# EAGLE design Expansionv3 (EAGLE 8.5.0)

## Sheet 1 of 2
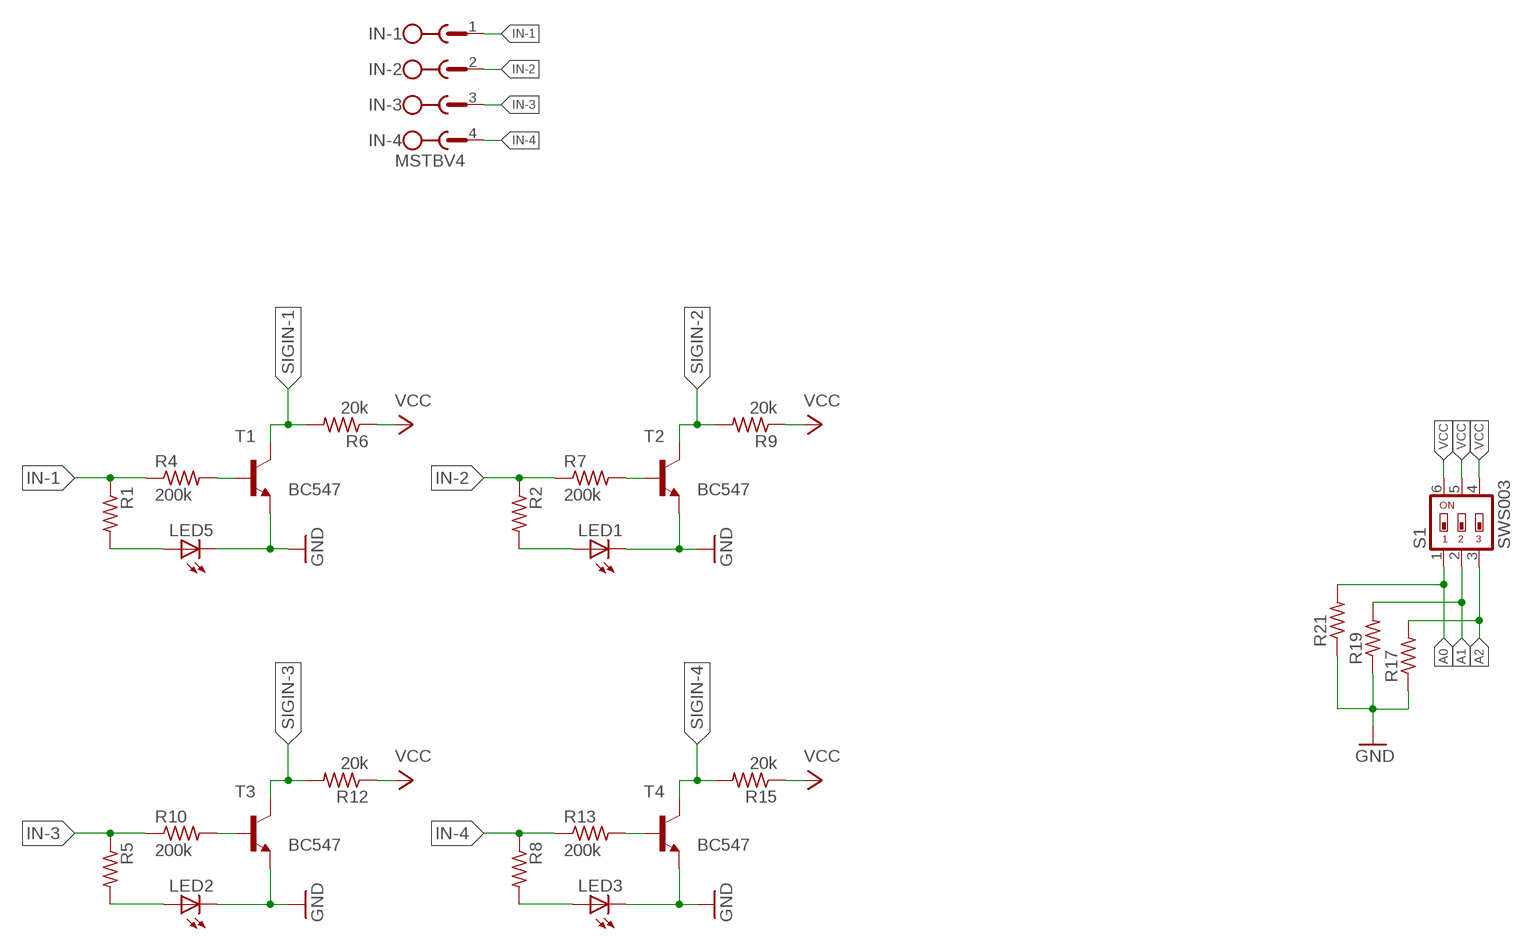
[diagram p0: schematic, sheet 1, part 1 of 2]
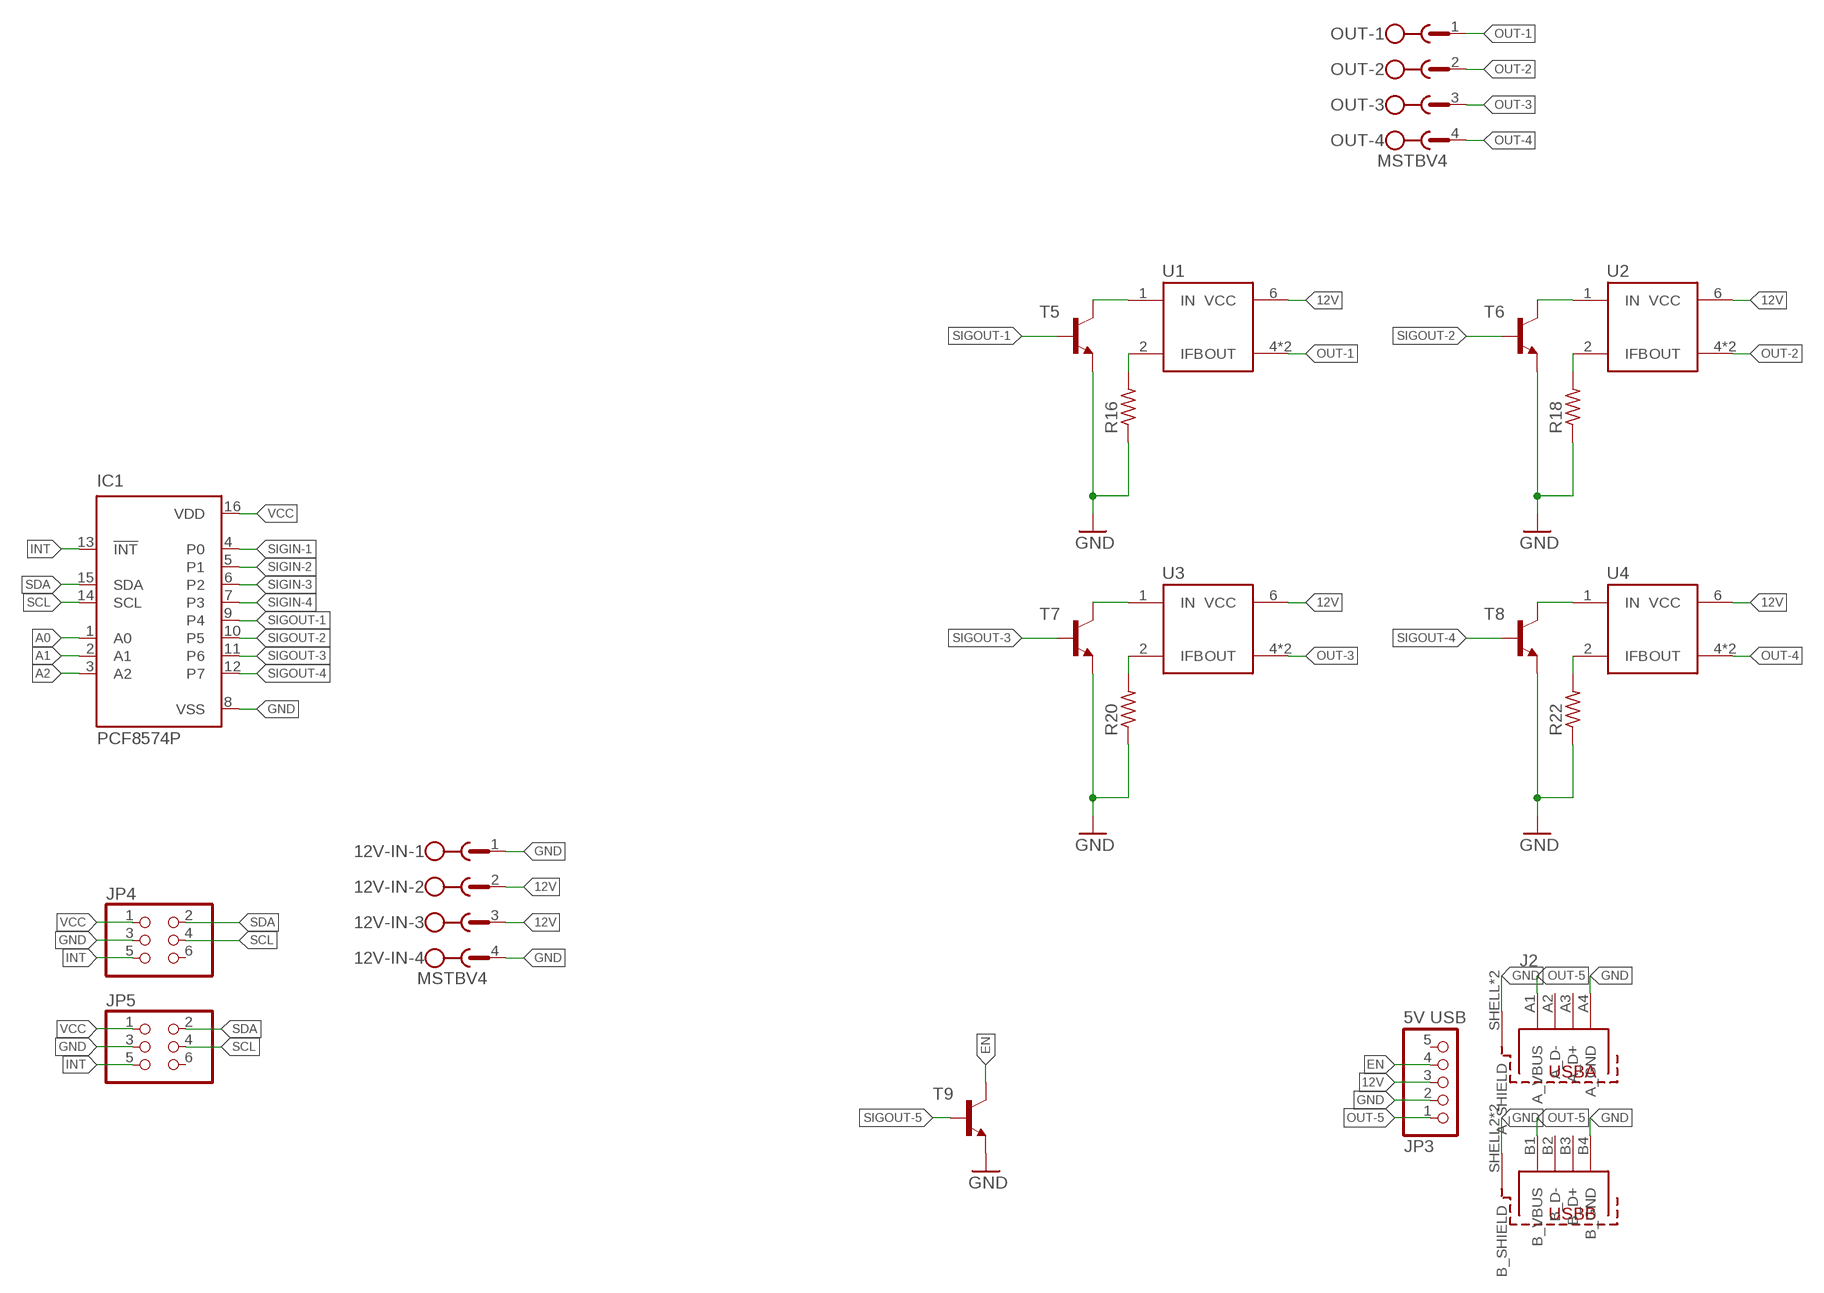
[diagram p1: schematic, sheet 1, part 2 of 2]

### Parts
12V-IN  MSTBV4  [MSTBV4]
IC1  PCF8574P  [DIL16]
IN  MSTBV4  [MSTBV4]
J2  614008235023  [614008235023]
JP3  5V USB  PINHD-1X5  [1X05]
JP4  PINHD-2X3  [2X03]
JP5  PINHD-2X3  [2X03]
LED1  LEDCHIPLED_0805  [CHIPLED_0805]
LED2  LEDCHIPLED_0805  [CHIPLED_0805]
LED3  LEDCHIPLED_0805  [CHIPLED_0805]
LED5  LEDCHIPLED_0805  [CHIPLED_0805]
OUT  MSTBV4  [MSTBV4]
R1  R-US_R0805  [R0805]
R2  R-US_R0805  [R0805]
R4  200k  R-US_R0805  [R0805]
R5  R-US_R0805  [R0805]
R6  20k  R-US_R0805  [R0805]
R7  200k  R-US_R0805  [R0805]
R8  R-US_R0805  [R0805]
R9  20k  R-US_R0805  [R0805]
R10  200k  R-US_R0805  [R0805]
R12  20k  R-US_R0805  [R0805]
R13  200k  R-US_R0805  [R0805]
R15  20k  R-US_R0805  [R0805]
R16  R-US_R0805  [R0805]
R17  R-US_R0805  [R0805]
R18  R-US_R0805  [R0805]
R19  R-US_R0805  [R0805]
R20  R-US_R0805  [R0805]
R21  R-US_R0805  [R0805]
R22  R-US_R0805  [R0805]
S1  SWS003  [SMS-003]
T1  BC547  -NPN-SOT23-EBC  [SOT23-EBC]
T2  BC547  -NPN-SOT23-EBC  [SOT23-EBC]
T3  BC547  -NPN-SOT23-EBC  [SOT23-EBC]
T4  BC547  -NPN-SOT23-EBC  [SOT23-EBC]
T5  -NPN-SOT23-EBC  [SOT23-EBC]
T6  -NPN-SOT23-EBC  [SOT23-EBC]
T7  -NPN-SOT23-EBC  [SOT23-EBC]
T8  -NPN-SOT23-EBC  [SOT23-EBC]
T9  -NPN-SOT23-EBC  [SOT23-EBC]
U1  IR3315  [TO263-5]
U2  IR3315  [TO263-5]
U3  IR3315  [TO263-5]
U4  IR3315  [TO263-5]

### Nets
12V [pwr]: 12V-IN.2 12V-IN.3 JP3.3 U1.6(VCC) U2.6(VCC) U3.6(VCC) U4.6(VCC)
A0: IC1.1(A0) R21.2 S1.1
A1: IC1.2(A1) R19.2 S1.2
A2: IC1.3(A2) R17.2 S1.3
EN: JP3.4 T9.C
GND: 12V-IN.1 12V-IN.4 IC1.8(VSS) J2.A4(A_GND) J2.B4(B_GND) J2.SHELL1(A_SHIELD) J2.SHELL2(B_SHIELD) J2.SHELL3(B_SHIELD) J2.SHELL(A_SHIELD) JP3.2 JP4.3 JP5.3 LED1.C LED2.C LED3.C LED5.C R16.1 R17.1 R18.1 R19.1 R20.1 R21.1 R22.1 T1.E T2.E T3.E T4.E T5.E T6.E T7.E T8.E T9.E
IN-1: IN.1 R1.1 R4.1
IN-2: IN.2 R2.1 R7.1
IN-3: IN.3 R5.1 R10.1
IN-4: IN.4 R8.1 R13.1
INT: IC1.13(!INT) JP4.5 JP5.5
N$3: LED5.A R1.2
N$4: R4.2 T1.B
N$5: LED1.A R2.2
N$6: R7.2 T2.B
N$7: LED2.A R5.2
N$8: R10.2 T3.B
N$9: LED3.A R8.2
N$10: R13.2 T4.B
N$12: T5.C U1.1(IN)
N$13: R16.2 U1.2(IFB)
N$15: T6.C U2.1(IN)
N$16: R18.2 U2.2(IFB)
N$18: T7.C U3.1(IN)
N$19: R20.2 U3.2(IFB)
N$21: T8.C U4.1(IN)
N$22: R22.2 U4.2(IFB)
OUT-1 [pwr]: OUT.1 U1.4(OUT) U1.5(OUT)
OUT-2 [pwr]: OUT.2 U2.4(OUT) U2.5(OUT)
OUT-3 [pwr]: OUT.3 U3.4(OUT) U3.5(OUT)
OUT-4 [pwr]: OUT.4 U4.4(OUT) U4.5(OUT)
OUT-5: J2.A1(A_VBUS) J2.B1(B_VBUS) JP3.1
SCL: IC1.14(SCL) JP4.4 JP5.4
SDA: IC1.15(SDA) JP4.2 JP5.2
SIGIN-1: IC1.4(P0) R6.2 T1.C
SIGIN-2: IC1.5(P1) R9.2 T2.C
SIGIN-3: IC1.6(P2) R12.2 T3.C
SIGIN-4: IC1.7(P3) R15.2 T4.C
SIGOUT-1: IC1.9(P4) T5.B
SIGOUT-2: IC1.10(P5) T6.B
SIGOUT-3: IC1.11(P6) T7.B
SIGOUT-4: IC1.12(P7) T8.B
SIGOUT-5: T9.B
VCC: IC1.16(VDD) JP4.1 JP5.1 R6.1 R9.1 R12.1 R15.1 S1.4 S1.5 S1.6
Unconnected: J2.A2(A_D-) J2.A3(A_D+) J2.B2(B_D-) J2.B3(B_D+) JP3.5 JP4.6 JP5.6

## Sheet 2 of 2

## Library data of the parts
12V-IN IN OUT = con-phoenix-508:MSTBV4: PHOENIX; MPN: MSTBV 2,5/4-GF-5.08; OC_FARNELL: 1792794; OC_NEWARK: 69R9847
IC1 = micro-philips:PCF8574: I2C-Bus Remote 8-bit I/O expander http://www.semiconductors.philips.com/acrobat_download/datasheets/PCF8574_4.pdf; MPN: PCF8574PN; OC_FARNELL: 204020; OC_NEWARK: 11N8515
J2 = InputOutputIO (rev17e):614008235023: WR-COM Vertical Dual USB Type A=>Code : Con_I-O_COM_USB-2.0_A_614008235023 <http://katalog.we-online.de/media/images/eican/Con_I-O_COM_USB-2.0_A_614008235023_pf2.jpg> Details see: http://katalog.we-online.de/en/em/614_008_235_023 Created 2014-07-09, Karrer Zheng 2014 (C) Würth Elektronik
JP3 = pinhead:PINHD-1X5: PIN HEADER
JP4 JP5 = pinhead:PINHD-2X3: PIN HEADER
LED1-LED3 LED5 = led:LED: LED OSRAM: - CHIPLED LG R971, LG N971, LY N971, LG Q971, LY Q971, LO R971, LY R971 LH N974, LH R974 LS Q976, LO Q976, LY Q976 LO Q996 - Hyper CHIPLED LW Q18S LB Q993, LB Q99A, LB R99A - SideLED LS A670, LO A670, LY A670, LG A670, LP A670 LB A673, LV A673, LT A673, LW A673 LH A674 LY A675 LS A676, LA A676, LO A676, LY A676, LW A676 LS A679, LY A679, LG A679 - Hyper Micro SIDELED® LS Y876, LA Y876, LO Y876, LY Y876 LT Y87S - SmartLED LW L88C, LW L88S LB L89C, LB L89S, LG L890 LS L89K, LO L89K, LY L89K LS L896, LA L896, LO L896, LY L896 - TOPLED LS T670, LO T670, LY T670, LG T670, LP T670 LSG T670, LSP T670, LSY T670, LOP T670, LYG T670 LG T671, LOG T671, LSG T671 LB T673, LV T673, LT T673, LW T673 LH T674 LS T676, LA T676, LO T676, LY T676, LB T676, LH T676, LSB T676, LW T676 LB T67C, LV T67C, LT T67C, LS T67K, LO T67K, LY T67K, LW E67C LS E67B, LA E67B, LO E67B, LY E67B, LB E67C, LV E67C, LT E67C LW T67C LS T679, LY T679, LG T679 LS T770, LO T770, LY T770, LG T770, LP T770 LB T773, LV T773, LT T773, LW T773 LH T774 LS E675, LA E675, LY E675, LS T675 LS T776, LA T776, LO T776, LY T776, LB T776 LHGB T686 LT T68C, LB T68C - Hyper Mini TOPLED® LB M676 - Mini TOPLED Santana® LG M470 LS M47K, LO M47K, LY M47K Source: http://www.osram.convergy.de LUXEON: - LUMILED® LXK2-PW12-R00, LXK2-PW12-S00, LXK2-PW14-U00, LXK2-PW14-V00 LXK2-PM12-R00, LXK2-PM12-S00, LXK2-PM14-U00 LXK2-PE12-Q00, LXK2-PE12-R00, LXK2-PE12-S00, LXK2-PE14-T00, LXK2-PE14-U00 LXK2-PB12-K00, LXK2-PB12-L00, LXK2-PB12-M00, LXK2-PB14-N00, LXK2-PB14-P00, LXK2-PB14-Q00 LXK2-PR12-L00, LXK2-PR12-M00, LXK2-PR14-Q00, LXK2-PR14-R00 LXK2-PD12-Q00, LXK2-PD12-R00, LXK2-PD12-S00 LXK2-PH12-R00, LXK2-PH12-S00 LXK2-PL12-P00, LXK2-PL12-Q00, LXK2-PL12-R00 Source: www.luxeon.com KINGBRIGHT: KA-3528ASYC Source: www.kingbright.com
R1 R2 R4-R10 R12 R13 R15-R22 = resistor:R-US_: RESISTOR, American symbol
S1 = smd-special:SWS003: SMD Dip Switch 3 pol.
T1-T9 = transistor:*-NPN-: NPN Transistror BF959 corrected 2008.03.06
U1-U4 = jgennari:IR3315

## Net classes
0 default: width 0.203 mm, drill 0.305 mm
1 pwr: width 0.559 mm, drill 0.305 mm

## Board
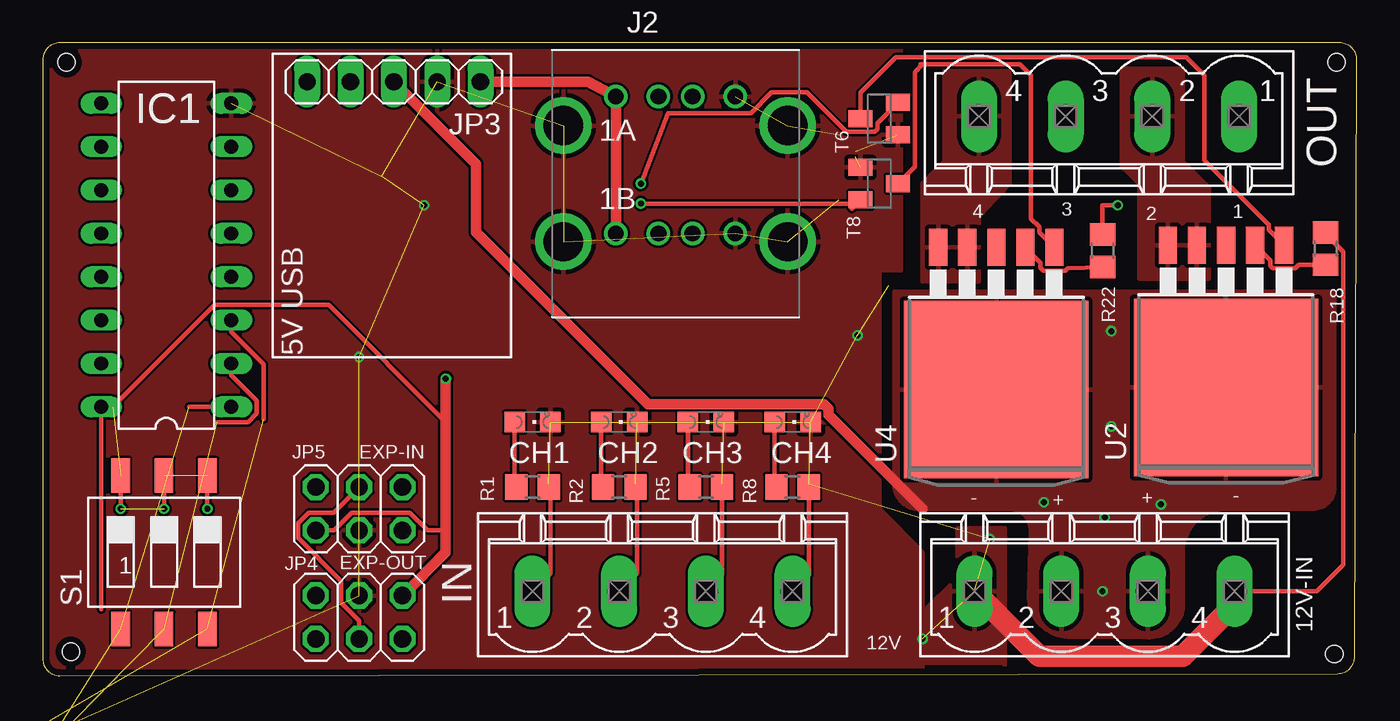
[diagram p2: board, top side]
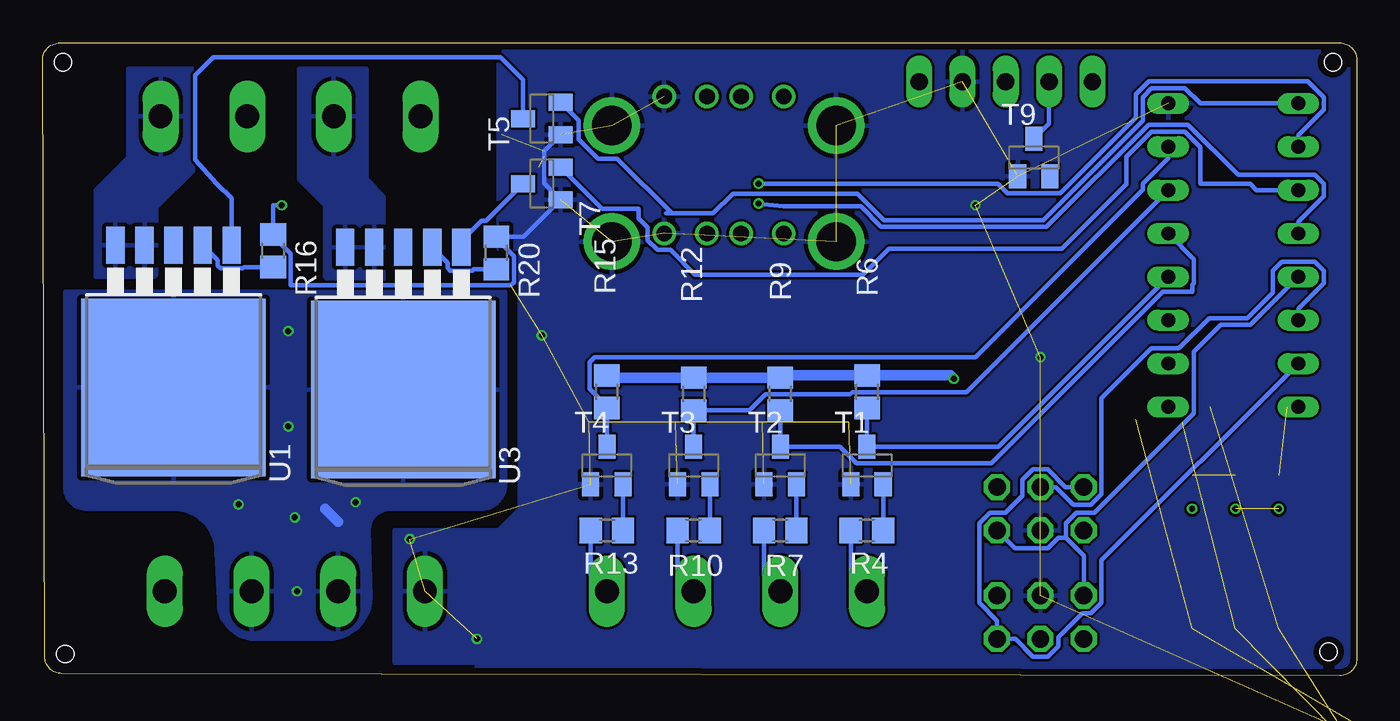
[diagram p3: board, bottom side, seen from below]

Size 77.01 x 37.07 mm. Coordinates in mm from the lower left corner, seen from the top.
Outline: 76.01,37.07 1.01,37.07 arc90 0.01,36.07 0,1 arc90 1,0 75.89,0.13 arc90 76.89,1.12 77.01,36.07 arc90 76.01,37.07
Copper layers (1*16): Top 0.035559375mm / dielectric 1.6mm / Bottom 0.035559375mm
Design rules "oshpark-2layer": minimum track width 6mil, minimum drill 10mil, track to track 6mil, track to pad 6mil, pad to pad 6mil, via to via 6mil, smd to smd 6mil, copper to edge 15mil, drill to drill 6mil, minimum pad ring 5mil, minimum via ring 5mil, stop-mask expansion 2.5mil, vias tented up to drill 0mil, thermal gap 10mil
Holes 1 mm at 1.65,1.4 1.4,35.94 75.7,1.27 75.82,35.94

### Footprints (pad centres in the part's own frame; a part is rotated, then mirrored left to right if it is on the bottom)
MSTBV4 = drill 1.397 long: 1 -7.62,0; 2 -2.54,0; 3 2.54,0; 4 7.62,0
DIL16 = drill 0.813 long: 1 -8.89,-3.81; 2 -6.35,-3.81; 3 -3.81,-3.81; 4 -1.27,-3.81; 5 1.27,-3.81; 6 3.81,-3.81; 7 6.35,-3.81; 8 8.89,-3.81; 9 8.89,3.81; 10 6.35,3.81; 11 3.81,3.81; 12 1.27,3.81; 13 -1.27,3.81; 14 -3.81,3.81; 15 -6.35,3.81; 16 -8.89,3.81
614008235023 = drill 0.92: A1 -3.5,5.1; A2 -1,5.1; A3 1,5.1; A4 3.5,5.1; B1 -3.5,-2.92; B2 -1,-2.92; B3 1,-2.92; B4 3.5,-2.92 | drill 2.3: SHELL -6.57,3.4; SHELL1 6.57,3.4; SHELL2 -6.57,-3.4; SHELL3 6.57,-3.4
1X05 = drill 1.016 long: 1 -5.08,0; 2 -2.54,0; 3 0,0; 4 2.54,0; 5 5.08,0
2X03 = drill 1.016 octagon: 1 -2.54,-1.27; 2 -2.54,1.27; 3 0,-1.27; 4 0,1.27; 5 2.54,-1.27; 6 2.54,1.27
CHIPLED_0805 = smd 1.2 x 1.2: A 0,-1.05; C 0,1.05
R0805 = smd 1.3 x 1.5: 1 -0.95,0; 2 0.95,0
SMS-003 = smd 1.092 x 2.007: 1 -2.54,-4.496; 2 0,-4.496; 3 2.54,-4.496; 4 2.54,4.496; 5 0,4.496; 6 -2.54,4.496
SOT23-EBC = smd 1 x 1.4: B 0.95,-1.1; C 0,1.1; E -0.95,-1.1
TO263-5 = smd 1.067 x 2.159: 1 -3.404,-5.791; 2 -1.702,-5.791; 3 0,-5.791; 4 1.702,-5.791; 5 3.404,-5.791 | smd 10.8 x 10.41: 6 0,2.54

### Placement (x,y rotation side)
12V-IN  62.23,4.95 0 top
IC1  7.24,24.64 90 top
IN  36.33,4.95 0 top
J2  37.09,28.83 0 top
JP3  20.58,34.8 180 top
JP4  18.55,3.43 180 top
JP5  18.55,9.78 0 top
LED1  33.79,14.86 270 top
LED2  38.87,14.86 270 top
LED3  43.95,14.86 270 top
LED5  28.71,14.86 270 top
OUT  62.49,32.77 180 top
R1  28.71,11.05 180 top
R2  33.79,11.05 180 top
R4  28.71,8.51 0 bottom
R5  38.87,11.05 180 top
R6  28.71,16.64 270 bottom
R7  33.79,8.51 0 bottom
R8  43.95,11.05 180 top
R9  33.79,16.51 270 bottom
R10  38.87,8.51 0 bottom
R12  38.87,16.51 270 bottom
R13  43.95,8.51 0 bottom
R15  43.95,16.64 270 bottom
R16  63.5,24.89 270 bottom
R17  -11.93,-9.27 0 top  (outside the outline)
R18  75.19,25.02 270 top
R19  -11.93,-15.62 0 top  (outside the outline)
R20  50.42,24.76 270 bottom
R21  -11.93,-21.97 0 top  (outside the outline)
R22  62.11,24.89 270 top
S1  7.12,7.24 0 top
T1  28.71,12.32 0 bottom
T2  33.79,12.32 0 bottom
T3  38.87,12.32 0 bottom
T4  43.95,12.32 0 bottom
T5  47.76,32.64 90 bottom
T6  49.03,32.64 90 top
T7  47.76,28.83 90 bottom
T8  49.03,28.83 270 top
T9  18.93,30.35 0 bottom
U1  69.35,19.43 180 bottom
U2  69.35,19.43 180 top
U3  55.88,19.3 180 bottom
U4  55.88,19.3 180 top

### Tracks (layer width: path | path; a pad name or v marks a point on that pad's centre or on a via)
12V  (via drill 0.35)
  Top 0.61: JP3.3 25.41,29.97 25.41,25.97 35.46,15.92 45.78,15.92 46.05,15.65 46.05,15.29 51.57,9.78
  Bottom 0.61: 59.69,9.02 60.46,9.78
  other vias: 58.68,10.16 62.23,9.27 62.11,4.95 65.54,10.03 62.61,14.61 62.61,20.19
  pour Top: 49.91,22.48 49.91,11.05 arc90 51.57,9.78 56.65,9.78 arc-90 57.92,8.51 57.79,4.57 arc90 60.33,2.29 64.52,2.29 arc90 66.81,3.94 66.81,7.24 arc-90 69.35,9.78 74.43,9.78 arc90 75.7,11.05 75.7,22.48
  pour Bottom: 49.91,22.48 49.91,11.05 arc90 51.57,9.78 56.65,9.78 arc-90 57.92,8.51 57.79,4.57 arc90 60.46,2.16 64.65,2.16 arc90 66.68,4.45 66.81,7.24 arc-90 69.35,9.78 74.43,9.78 arc90 75.7,11.05 75.7,22.48
A0  (2 unrouted)
  Top 0.254: 8.59,15.75 IC1.1
A1  (2 unrouted)
  Top 0.254: 10.24,14.86 12.03,14.86 12.55,15.38 12.55,16.12 11.05,17.62 IC1.2
A2  (2 unrouted)
  Top 0.254: IC1.3 11.05,20.15 12.96,18.25 12.96,15.04
EN
  Bottom 0.254: JP3.4 18.04,32.34 T9.C
GND  (via drill 0.35)  (30 unrouted)
  Top 0.254: R18.1 75.19,25.86 76.22,24.83 76.22,6.49 74.68,4.95 12V-IN.4 | 62.11,25.74 R22.1 62.11,27.56 v63,27.56 | T8.E 48.22,29.78
  Top 1.27: 12V-IN.1 58.42,1.14 66.81,1.14 69.85,4.19 12V-IN.4
  Bottom 0.254: T5.E 47.63,30.72 47.63,30.4 47.63,30.39 47.63,28.86 T7.E 48.82,25.71 R20.1 50.42,25.61 49.39,24.58 49.39,23.05 49.58,22.86 62.47,22.86 62.47,24.71 63.5,25.74 R16.1 63.5,27.56 v63,27.56
  other vias: 51.57,2.16 18.55,18.67 22.36,27.56 47.76,19.94 55.5,8
  pour Top: -14.47,37.72 -14.47,-4.19 51.57,-4.19 51.57,7.24 49.03,9.78 49.03,23.75 50.3,23.75 50.3,37.72
  pour Bottom: -14.47,38.99 -14.47,-2.92 51.57,-2.92 51.57,7.24 49.03,9.78 49.03,25.02 50.3,25.02 50.3,38.99
  pour Top: 51.18,3.68 51.57,3.68 53.6,5.71 53.6,8.64 56.39,8.64 56.39,0.63 56.26,0.76 50.42,0.76 50.42,2.92
  pour Bottom: 49.03,8.51 56.39,8.51 56.39,0.76 48.9,0.76 48.9,8.38
IN-1
  Top 0.254: R1.1 29.76,10.95 29.76,6 IN.1
  Bottom 0.254: R4.1 29.66,5.9 IN.1
IN-2
  Top 0.254: R2.1 34.84,10.95 34.84,6 IN.2
  Bottom 0.254: R7.1 34.74,5.97 34.74,5.9 IN.2
IN-3
  Top 0.254: IN.3 39.82,5.9 R5.1
  Bottom 0.254: R10.1 39.82,5.9 IN.3
IN-4
  Top 0.254: R8.1 44.9,5.97 44.9,5.9 IN.4
  Bottom 0.254: IN.4 44.9,5.9 R13.1
INT
  Bottom 0.254: IC1.13 6.25,20.55 7.98,20.55 9.55,18.98 9.55,15.38 15.38,9.55 16.44,9.55 17.05,8.94 17.05,8.08 | JP4.5 16.01,7.04 17.05,8.08 | 17.05,8.08 17.5,8.08 18.11,7.47 20.04,7.47 JP5.5
N$3
  Top 0.254: LED5.A 27.66,11.15 R1.2
N$4
  Bottom 0.254: T1.B R4.2
N$5
  Top 0.254: LED1.A 32.74,11.15 R2.2
N$6
  Bottom 0.254: T2.B R7.2
N$7
  Top 0.254: LED2.A 37.82,11.15 R5.2
N$8
  Bottom 0.254: T3.B R10.2
N$9
  Top 0.254: LED3.A 42.9,11.15 R8.2
N$10
  Bottom 0.254: T4.B R13.2
N$12
  Bottom 0.254: U1.1 65.94,27.96 66.81,28.83 68.08,30.23 68.08,35.18 67.03,36.22 50.17,36.22 48.86,34.91 T5.C
N$13
  Bottom 0.254: U1.2 66.75,24.33 66.75,24.03 66.59,23.86 65.29,23.86 65.21,23.94 R16.2
N$15
  Top 0.254: U2.1 71.86,26.11 71.86,26.42 68.08,30.2 68.08,35.18 67.03,36.22 50,36.22 47.93,34.15 T6.C
N$16
  Top 0.254: U2.2 71.94,24.33 71.94,24.03 72.1,23.86 73.4,23.86 73.6,24.07 R18.2
N$18
  Bottom 0.254: T7.C 51.04,26.64 51.29,26.64 52.48,25.45 U3.1
N$19
  Bottom 0.254: R20.2 51.75,23.82 51.83,23.74 53.13,23.74 53.29,23.9 53.29,24.21 U3.2
N$21
  Top 0.254: U4.1 58.4,25.98 58.4,26.29 57.92,26.77 57.92,35.18 57.28,35.81 51.57,35.81 | 51.44,35.81 51.57,35.81 | T8.C 51.1,29.81 51.1,33.91 51.1,34.2 51.1,35.35 51.57,35.81
N$22
  Top 0.254: U4.2 58.47,24.21 58.47,23.9 58.64,23.74 59.94,23.74 60.08,23.88 R22.2
OUT-1
  pour Bottom: 70.49,23.37 73.92,23.37 73.92,28.45 72.01,30.35 72.01,35.56 68.2,35.56 68.2,30.23 68.2,29.59 70.36,27.43 70.36,23.5
OUT-2
  pour Top: 64.27,23.24 68.33,23.24 68.33,28.57 66.81,30.1 66.81,35.56 63.25,35.56 63.25,29.85 64.27,28.83
OUT-3
  pour Bottom: 57.03,23.24 60.33,23.24 60.46,23.37 60.46,27.56 61.98,29.08 61.98,35.56 58.04,35.56 58.04,29.08 57.03,28.07
OUT-4
  pour Top: 51.57,23.11 54.87,23.11 54.87,26.92 56.65,28.83 56.65,35.43 52.84,35.43 52.84,30.1 51.57,28.83
OUT-5
  Top 0.61: JP3.1 31.96,34.8 J2.A1 J2.B1
SCL
  Top 0.254: JP4.4 18.55,3.23 17.5,4.27 17.5,5.54 14.96,8.08 14.96,8.94 15.57,9.55 17.05,9.55 JP5.4
  Bottom 0.254: JP5.4 17.65,11.05 16.61,10.01 15.57,10.01 14.96,10.62 14.96,16.24 12.03,19.18 10.42,19.18 8.64,20.96 6.42,20.96 4.93,22.44 4.93,23.74 4.41,24.26 2.45,24.26 1.93,23.74 1.93,23 3.43,21.5 IC1.14
SDA
  Bottom 0.254: JP5.2 17.07,11.05 18.11,12.09 18.98,12.09 19.59,11.48 19.59,10.55 20.58,9.55 21.52,9.55 22.13,8.94 22.13,4.27 21.09,3.23 JP4.2 20.02,2.16 18.98,1.12 18.11,1.12 17.5,1.73 17.5,2.25 16.1,3.66 15.57,3.66 14.96,4.27 14.96,4.7 14.96,4.79 14.96,6.76 IC1.15
SIGIN-1
  Bottom 0.254: R6.2 T1.C 21,13.42 IC1.4
SIGIN-2
  Bottom 0.254: R9.2 T2.C 30.3,13.42 29.32,12.44 21.41,12.44 11.37,22.48 9.66,22.48 9.66,22.9 9.55,23 9.55,24.41 IC1.5
SIGIN-3
  Bottom 0.254: T3.C R12.2 35.58,15.56 34.65,16.49 29.7,16.49 29.57,16.62 22.88,16.62 IC1.6
SIGIN-4
  Bottom 0.254: T4.C R15.2 43.95,15.79 44.97,16.82 44.97,18.35 44.66,18.67 22.36,18.67 12.55,28.47 12.55,28.82 11.05,30.32 IC1.7
SIGOUT-1
  Bottom 0.254: IC1.9 9.19,33.53 10.07,34.42 12.03,34.42 12.55,33.9 12.55,32.51 18.36,26.7 27.71,26.7 29.26,28.24 36.57,28.24 37.73,27.08 40.14,27.08 | 40.14,27.08 40.49,27.08 | 40.14,27.08 43.35,30.29 44.46,30.29 45.59,31.43 45.59,32.53 T5.B
SIGOUT-2  (via drill 0.35)
  Top 0.254: v35.06,28.83 36.65,32.96 41.5,32.96 42.7,34.17 44.8,34.17 47.11,31.86 48.74,31.86 48.9,32.02 48.9,32.37 T6.B
  Bottom 0.254: v35.06,28.83 21.05,28.83 20.49,28.27 17.36,28.27 12.96,32.68 12.96,34.06 12.2,34.82 2.86,34.82 1.93,33.9 1.93,33.16 3.43,31.66 IC1.10
SIGOUT-3
  Bottom 0.254: T7.B 44.24,27.37 42.09,27.37 42.09,26.81 41.56,26.27 41.56,25.51 40.99,24.94 40.23,24.94 38.78,23.49 28.95,23.49 27.43,25.02 17.28,25.02 13.49,28.8 13.49,30.41 12.03,31.88 10.07,31.88 9.16,30.97 9.16,28.81 6.25,28.81 5.89,28.45 IC1.11
SIGOUT-4  (via drill 0.35)
  Top 0.254: 47.41,27.37 47.68,27.63 | 47.68,27.63 T8.B | v35.06,27.66 47.65,27.66 47.68,27.63
  Bottom 0.254: IC1.12 3.43,26.58 1.93,28.08 1.93,28.82 2.45,29.34 6.96,29.34 9.91,32.28 12.2,32.28 18.19,26.29 27.88,26.29 29.07,27.49 33.61,27.49 v35.06,27.66
VCC  (via drill 0.35)  (3 unrouted)
  Top 0.254: JP5.1 17.07,8.51 18.11,9.55 21.52,9.55 22.56,8.51 23.63,8.51 | 3.43,3.89 IC1.16 4.11,15.75 10.07,21.72 16.77,21.72 23.63,14.86 | v4.58,9.78 S1.6 | S1.5 v7.12,9.78 | v9.66,9.78 S1.4
  Top 0.61: JP4.1 23.63,7.24 23.63,8.51 23.63,14.86 v23.63,17.4
  Bottom 0.61: v23.63,17.4 23.81,17.59 R6.1 33.66,17.59 R9.1 R12.1 43.82,17.46 R15.1

### Text on the board
tPlace: 4 | 3 | 2 | 1 | - | + | + | -
tNames: EXP-IN | CH1 | CH2 | CH3 | CH4 | EXP-OUT | 12V